# EasyEDA Pro project Buspirate_Main.epro

# Schematic BusPirate_PCB
Board Name: Board1; Create Date: 2026-04-15; Page Name: P1; Project Name: ESP32_Buspirate_complete; Schematic Name: Schematic1; Update Date: 2026-04-15; Company: EasyEDA.com; Page Size: A4; Version: V1.0
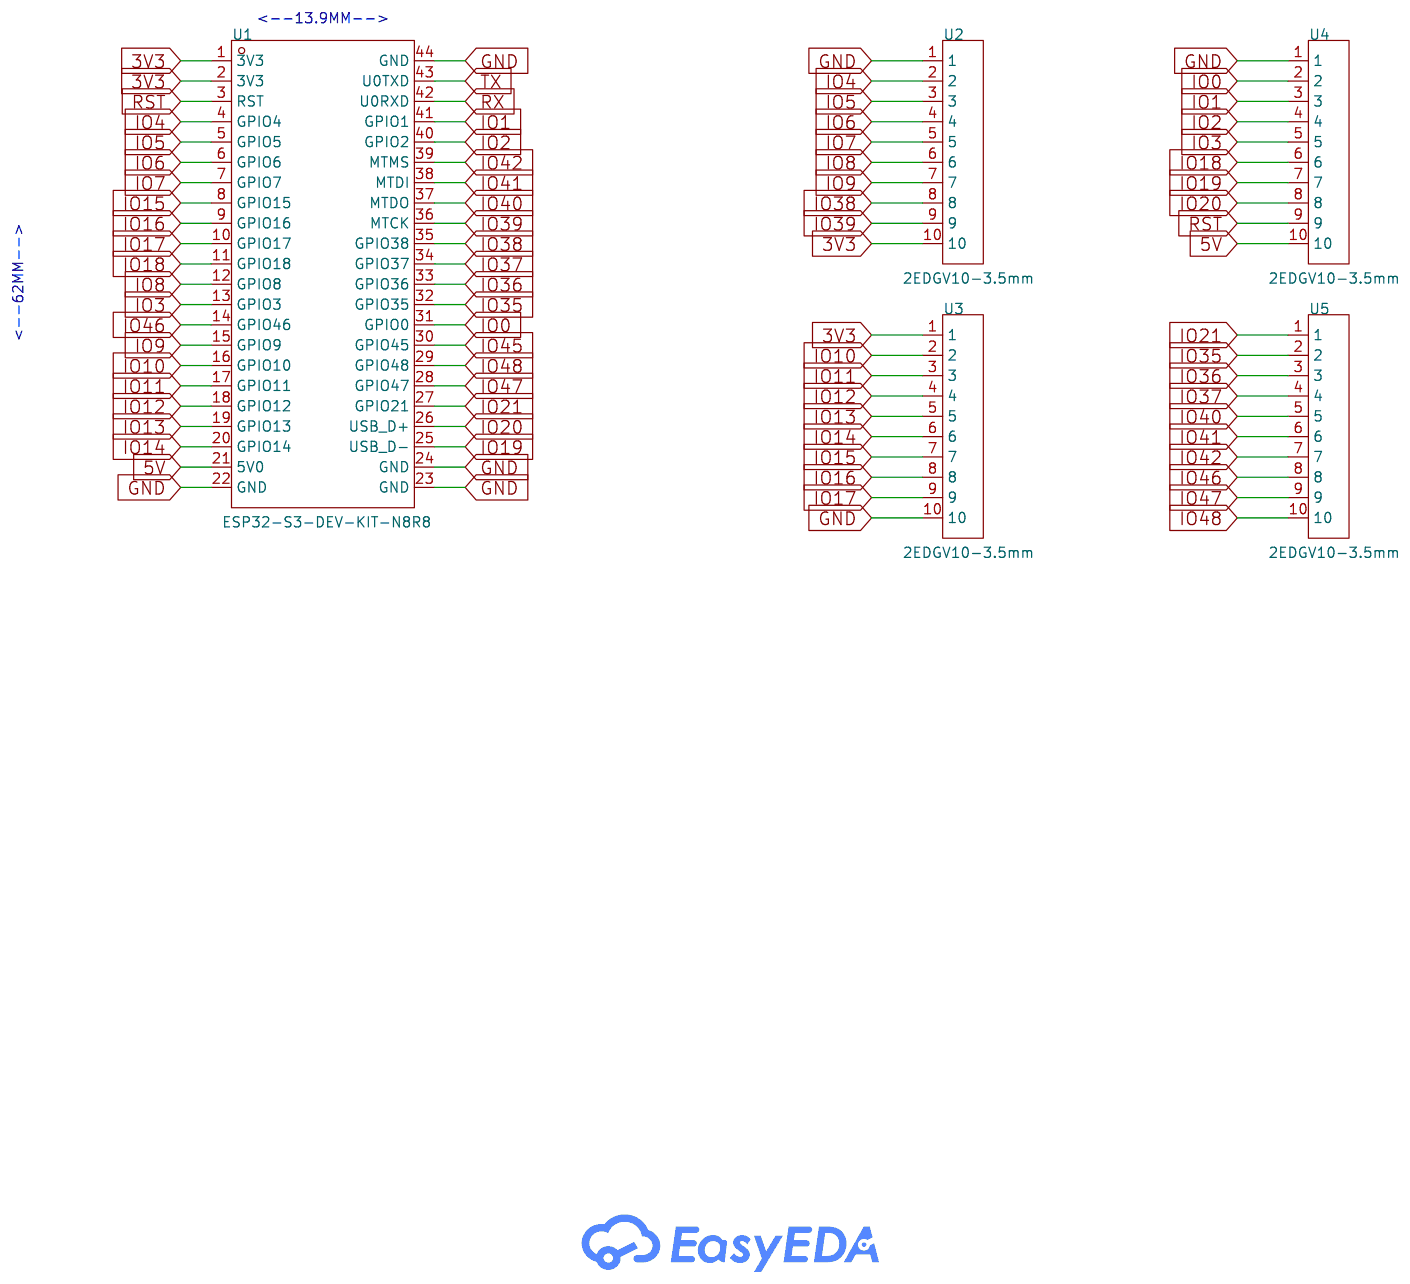
[diagram p0: schematic sheet]

## Parts
U1  ESP32-S3-DEV-KIT-N8R8  [COMM-TH_ESP32-S3-DEVKITC-N16R8]
U2  2EDGV10-3.5mm  [CONN-TH_10P-P2.50_B10B-EH-A-LF-SN]
U3  2EDGV10-3.5mm  [CONN-TH_10P-P2.50_B10B-EH-A-LF-SN]
U4  2EDGV10-3.5mm  [CONN-TH_10P-P2.50_B10B-EH-A-LF-SN]
U5  2EDGV10-3.5mm  [CONN-TH_10P-P2.50_B10B-EH-A-LF-SN]

## Library data of the parts
U1 = ESP32-S3-DEV-KIT-N8R8: Supplier Part: C9900170771; Supplier Footprint: SMD; Supplier: LCSC
U2-U5 = CONN-TH_10P-P3.50: Supplier Part: C9900014909; Supplier Footprint: 2EDG_10p_3.5mm; JLCPCB Part Class: Extended Part; Supplier: LCSC

## Nets
3V3: U1.1(3V3) U1.2(3V3) U2.10 U3.1
5V: U1.21(5V0) U4.10
GND: U1.22(GND) U1.23(GND) U1.24(GND) U1.44(GND) U2.1 U3.10 U4.1
IO0: U1.31(GPIO0) U4.2
IO1: U1.41(GPIO1) U4.3
IO2: U1.40(GPIO2) U4.4
IO3: U1.13(GPIO3) U4.5
IO4: U1.4(GPIO4) U2.2
IO5: U1.5(GPIO5) U2.3
IO6: U1.6(GPIO6) U2.4
IO7: U1.7(GPIO7) U2.5
IO8: U1.12(GPIO8) U2.6
IO9: U1.15(GPIO9) U2.7
IO10: U1.16(GPIO10) U3.2
IO11: U1.17(GPIO11) U3.3
IO12: U1.18(GPIO12) U3.4
IO13: U1.19(GPIO13) U3.5
IO14: U1.20(GPIO14) U3.6
IO15: U1.8(GPIO15) U3.7
IO16: U1.9(GPIO16) U3.8
IO17: U1.10(GPIO17) U3.9
IO18: U1.11(GPIO18) U4.6
IO19: U1.25(USB_D-) U4.7
IO20: U1.26(USB_D+) U4.8
IO21: U1.27(GPIO21) U5.1
IO35: U1.32(GPIO35) U5.2
IO36: U1.33(GPIO36) U5.3
IO37: U1.34(GPIO37) U5.4
IO38: U1.35(GPIO38) U2.8
IO39: U1.36(MTCK) U2.9
IO40: U1.37(MTDO) U5.5
IO41: U1.38(MTDI) U5.6
IO42: U1.39(MTMS) U5.7
IO45: U1.30(GPIO45)
IO46: U1.14(GPIO46) U5.8
IO47: U1.28(GPIO47) U5.9
IO48: U1.29(GPIO48) U5.10
RST: U1.3(RST) U4.9
RX: U1.42(U0RXD)
TX: U1.43(U0TXD)

## Notes on the sheet
- <--13.9MM-->
- <--62MM-->

# Board PCB1
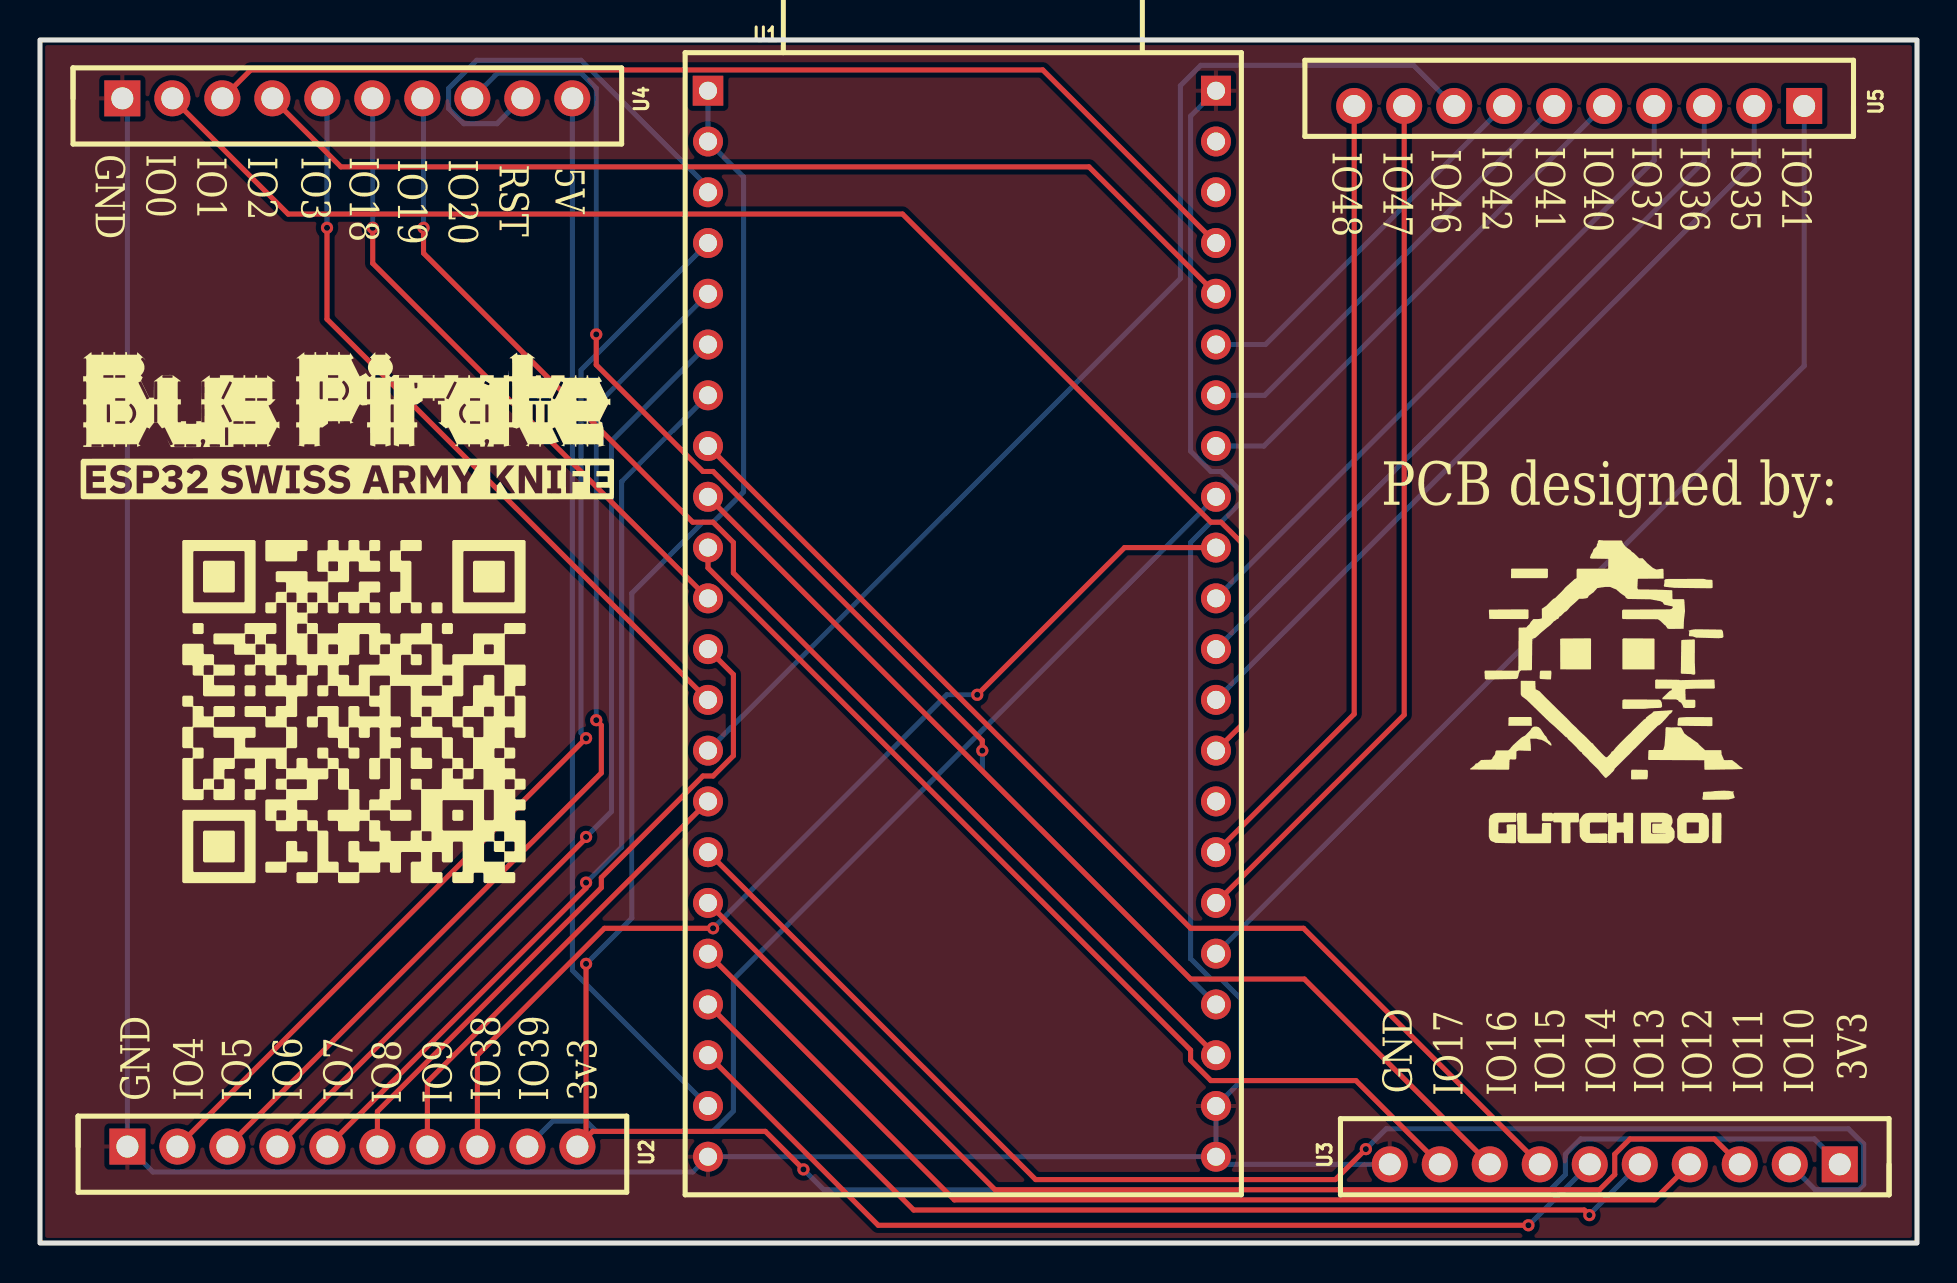
[diagram p1: board, top side]
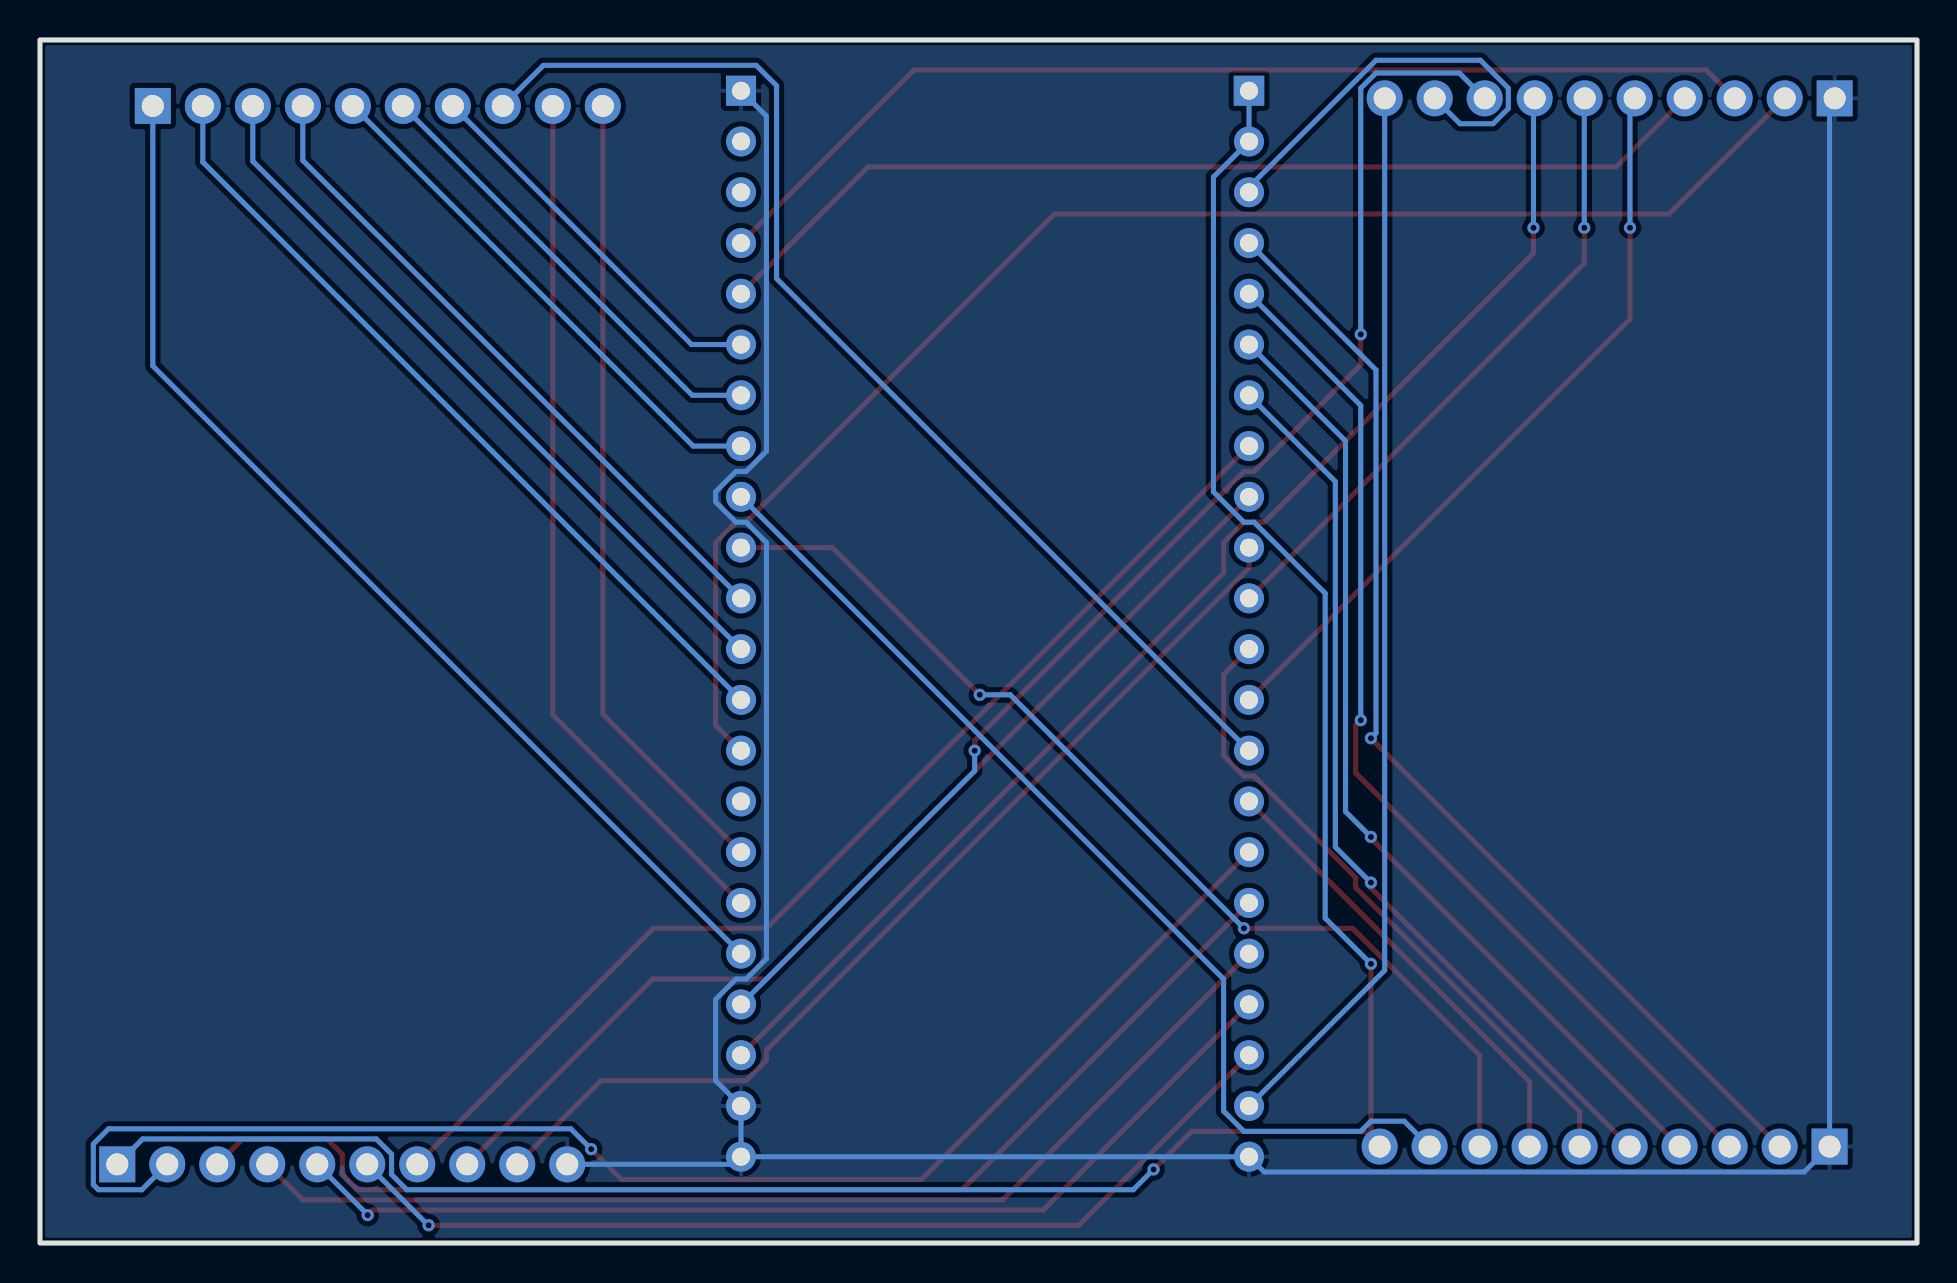
[diagram p2: board, bottom side, seen from below]

Outline 93.85 x 60.2 mm; copper layers: Top Layer, Bottom Layer. Coordinates in mm from the lower left corner of the outline.
Outline path: rectangle 0,60.2 93.85,0
Stack: Top Layer 0.035mm / Dielectric1 1.51mm FR4 er 4.5 / Bottom Layer 0.035mm

## Design rules (mm)
template: JLCPCB Capability(Two Layers Board)
spacing copperThickness1oz (default): track to track 0.102, other pairs 0.152 to 0.3
spacing copperThickness2oz: track to track 0.203, other pairs 0.152 to 0.3
track width copperThickness1oz (default): min 0.127, default 0.254, max 2.54
track width copperThickness2oz: min 0.203, default 0.254, max 2.54
differential pair differentialPair (default): width min 0.127, default 0.254, max 2.54; gap min 0.152, default 0.152
via viaSize (default): diameter min 0.5, default 0.61, max 10; hole min 0.3, default 0.305, max 6.3

## Placement (name value [footprint] x y rotation side)
U1  ESP32-S3-DEV-KIT-N8R8  [COMM-TH_ESP32-S3-DEVKITC-N16R8]  46.1 30.99 0 top
U2  2EDGV10-3.5mm  [CONN-TH_10P-P2.50_B10B-EH-A-LF-SN]  15.62 4.83 0 top
U3  2EDGV10-3.5mm  [CONN-TH_10P-P2.50_B10B-EH-A-LF-SN]  78.74 3.94 180 top
U4  2EDGV10-3.5mm  [CONN-TH_10P-P2.50_B10B-EH-A-LF-SN]  15.37 57.28 0 top
U5  2EDGV10-3.5mm  [CONN-TH_10P-P2.50_B10B-EH-A-LF-SN]  76.96 56.9 180 top

## Footprints (pads in the part's own frame, mm; a bottom-side part is the same pattern mirrored in y, then rotated)
COMM-TH_ESP32-S3-DEVKITC-N16R8
  rect 1.524x1.5 hole 0.9: 1(-12.7,26.67)
  round 1.5 hole 0.9: 2(-12.7,24.13) 3(-12.7,21.59) 4(-12.7,19.05) 5(-12.7,16.51) 6(-12.7,13.97) 7(-12.7,11.43) 8(-12.7,8.89) 9(-12.7,6.35) 10(-12.7,3.81) 11(-12.7,1.27) 12(-12.7,-1.27) 13(-12.7,-3.81) 14(-12.7,-6.35) 15(-12.7,-8.89) 16(-12.7,-11.43) 17(-12.7,-13.97) 18(-12.7,-16.51) 19(-12.7,-19.05) 20(-12.7,-21.59) 21(-12.7,-24.13) 22(-12.7,-26.67) 23(12.7,-26.67) 24(12.7,-24.13) 25(12.7,-21.59) 26(12.7,-19.05) 27(12.7,-16.51) 28(12.7,-13.97) 29(12.7,-11.43) 30(12.7,-8.89) 31(12.7,-6.35) 32(12.7,-3.81) 33(12.7,-1.27) 34(12.7,1.27) 35(12.7,3.81) 36(12.7,6.35) 37(12.7,8.89) 38(12.7,11.43) 39(12.7,13.97) 40(12.7,16.51) 41(12.7,19.05) 42(12.7,21.59) 43(12.7,24.13)
  rect 1.5x1.5 hole 0.9: 44(12.7,26.67)
CONN-TH_10P-P2.50_B10B-EH-A-LF-SN
  rect 1.8x1.8 hole 1.1: 1(-11.25,0)
  round 1.8 hole 1.1: 2(-8.75,0) 3(-6.25,0) 4(-3.75,0) 5(-1.25,0) 6(1.25,0) 7(3.75,0) 8(6.25,0) 9(8.75,0) 10(11.25,0)

## Nets
As in the schematic.

## Via types
v1: diameter 0.61, hole 0.305, Top Layer to Bottom Layer, 16 vias

## Routing (per net, layer and track width the routed paths; a pad name or vN(x,y) marks a point on that pad's centre or on a via; arc(x,y) is an arc through that point)
3V3: length 123.5
  Top Layer w0.254: U2.10 27.31,5.26 ; 27.31,5.26 27.63,5.59 36.27,5.59 v1(38.17,3.68) ; 27.31,5.26 v1(27.31,13.97)
  Bottom Layer w0.254: U3.1 88.72,5.21 77.04,5.21 76.27,4.44 76.27,3.43 75.51,2.67 39.19,2.67 v1(38.17,3.68) ; v1(27.31,13.97) 29.59,16.26 29.59,32.51 33.15,36.07 33.66,36.07 35.18,37.59 35.18,53.34 U1.2 U1.1
5V: length 53.2
  Bottom Layer w0.254: U4.10 26.62,13.64 U1.21
GND: length 175.1
  Bottom Layer w0.254: U4.1 4.37,57.02 U2.1 5.64,3.56 32.64,3.56 U1.22 U1.23 ; U1.23 U1.24 60.07,8.13 60.07,12.19 59.06,13.21 58.55,13.21 57.53,14.22 57.53,35.05 58.55,36.07 59.06,36.07 60.07,37.08 60.07,37.59 59.06,38.61 58.55,38.61 57.53,39.62 57.53,56.39 U1.44 ; U1.23 59.18,3.94 U3.10
IO0: length 73.6
  Top Layer w0.254: U1.31 60.07,25.91 60.07,35.05 59.06,36.07 58.55,36.07 43.13,51.49 12.41,51.49 U4.2
IO1: length 53.9
  Top Layer w0.254: U1.41 50.14,58.7 10.54,58.7 U4.3
IO2: length 51.2
  Top Layer w0.254: U1.40 52.45,53.85 15.05,53.85 U4.4
IO3: length 38.1
  Top Layer w0.254: U1.13 14.35,46.23 v1(14.35,50.8)
  Bottom Layer w0.254: v1(14.35,50.8) 14.35,57.04 U4.5
IO4: length 56.4
  Top Layer w0.254: v1(27.31,25.26) U2.2
  Bottom Layer w0.254: U1.4 27.05,43.69 27.05,25.51 v1(27.31,25.26)
IO5: length 52.8
  Top Layer w0.254: v1(27.81,26.16) 28.07,25.91 28.07,23.52 U2.3
  Bottom Layer w0.254: v1(27.81,26.16) 27.81,41.91 U1.5
IO6: length 49.1
  Top Layer w0.254: v1(27.31,20.32) 27.31,20.26 U2.4
  Bottom Layer w0.254: U1.6 28.57,40.13 28.57,21.59 v1(27.31,20.32)
IO7: length 45.5
  Top Layer w0.254: U2.5 27.31,17.76 v1(27.31,18.03)
  Bottom Layer w0.254: v1(27.31,18.03) 29.08,19.81 29.08,38.1 U1.7
IO8: length 33.1
  Top Layer w0.254: U1.12 34.67,28.45 34.67,24.38 33.66,23.37 33.15,23.37 28.07,18.29 28.07,17.78 16.87,6.58 U2.6
IO9: length 23.1
  Top Layer w0.254: U1.15 19.37,8.07 U2.7
IO10: length 72.3
  Top Layer w0.254: v1(66.29,4.7) 64.77,3.17 49.78,3.17 U1.16
  Bottom Layer w0.254: v1(66.29,4.7) 67.31,5.71 90.42,5.71 91.19,4.95 91.19,2.92 90.93,2.67 88.76,2.67 U3.2
IO11: length 59.7
  Top Layer w0.254: U1.17 47.75,2.67 77.98,2.67 78.74,3.43 78.74,4.44 79.5,5.21 83.72,5.21 U3.3
IO12: length 54.9
  Top Layer w0.254: U1.18 45.72,2.16 80.71,2.16 U3.4
IO13: length 52
  Top Layer w0.254: v1(77.47,1.4) 77.22,1.65 43.69,1.65 U1.19
  Bottom Layer w0.254: U3.5 77.47,1.42 v1(77.47,1.4)
IO14: length 48.9
  Top Layer w0.254: U1.20 41.91,0.89 v1(74.42,0.89)
  Bottom Layer w0.254: U3.6 74.44,0.89 v1(74.42,0.89)
IO15: length 56.5
  Top Layer w0.254: U1.8 57.53,15.75 63.18,15.75 U3.7
IO16: length 52.9
  Top Layer w0.254: U1.9 57.53,13.21 63.22,13.21 U3.8
IO17: length 50.3
  Top Layer w0.254: U1.10 33.4,33.78 57.53,9.65 57.53,9.14 58.55,8.13 65.8,8.13 U3.9
IO18: length 32
  Top Layer w0.254: v1(16.64,50.8) 16.64,49.02 U1.11
  Bottom Layer w0.254: U4.6 16.64,57.26 v1(16.64,50.8)
IO19: length 64.9
  Top Layer w0.254: U1.25 34.67,33.53 34.67,35.05 33.66,36.07 32.64,36.07 19.18,49.53 v1(19.18,50.8)
  Bottom Layer w0.254: U4.7 19.18,57.22 v1(19.18,50.8)
IO20: length 66
  Top Layer w0.254: v1(27.81,45.47) 27.81,43.94 33.15,38.61 33.66,38.61 47.12,25.15 v1(47.12,24.64)
  Bottom Layer w0.254: v1(27.81,45.47) 27.81,57.78 27.05,58.55 22.89,58.55 U4.8 ; v1(47.12,24.64) 47.12,23.62 U1.26
IO21: length 54.6
  Bottom Layer w0.254: U5.1 88.21,43.89 U1.27
IO35: length 40.9
  Bottom Layer w0.254: U5.2 85.71,54.09 U1.32
IO36: length 37.3
  Bottom Layer w0.254: U5.3 83.21,54.13 U1.33
IO37: length 33.7
  Bottom Layer w0.254: U1.34 80.71,54.17 U5.4
IO38: length 52
  Top Layer w0.254: U1.35 54.23,34.8 v1(46.86,27.43) ; v1(33.66,15.75) 28.22,15.75 21.87,9.4 U2.8
  Bottom Layer w0.254: v1(46.86,27.43) 45.34,27.43 v1(33.66,15.75)
IO39: length 52.2
  Bottom Layer w0.254: U2.9 25.64,6.1 27.31,6.1 27.81,5.59 33.66,5.59 34.67,6.6 34.67,13.21 U1.36
IO40: length 26.5
  Bottom Layer w0.254: U5.5 61.19,39.88 U1.37
IO41: length 22.9
  Bottom Layer w0.254: U5.6 61.23,42.42 U1.38
IO42: length 19.4
  Bottom Layer w0.254: U1.39 61.27,44.96 U5.7
IO46: length 58
  Bottom Layer w0.254: U1.14 57.02,48.26 57.02,57.91 58.04,58.93 68.68,58.93 U5.8
IO47: length 43.8
  Top Layer w0.254: U1.28 68.21,26.43 U5.9
IO48: length 40.2
  Top Layer w0.254: U1.29 65.71,26.47 U5.10
RST: length 22
  Bottom Layer w0.254: U1.3 33.4,52.83 27.05,59.18 21.83,59.18 20.43,57.78 20.43,56.77 21.2,56.01 22.85,56.01 U4.9

## Copper pours and planes (outline as drawn; the poured copper is in the pictures)
GND on Top Layer: 0,60.2 93.85,60.2 93.85,0 0,0
GND on Bottom Layer: 0,60.2 93.85,60.2 93.85,0 0,0

## Text on the board
Top Silkscreen Layer: GND | IO0 | IO1 | IO2 | IO3 | IO18 | IO19 | IO20 | RST | 5V | IO48 | IO47 | IO46 | IO42 | IO41 | IO40 | IO37 | IO36 | IO35 | IO21 | IO4 | IO5 | IO6 | IO7 | IO8 | IO9 | IO38 | IO39 | 3v3 | IO17 | IO16 | IO15 | IO14 | IO13 | IO12 | IO11 | IO10 | 3V3 | PCB designed by:
